# Altium schematic sheet BMS Master.SchDoc
size A; DrawnBy: Not Alvin Ha
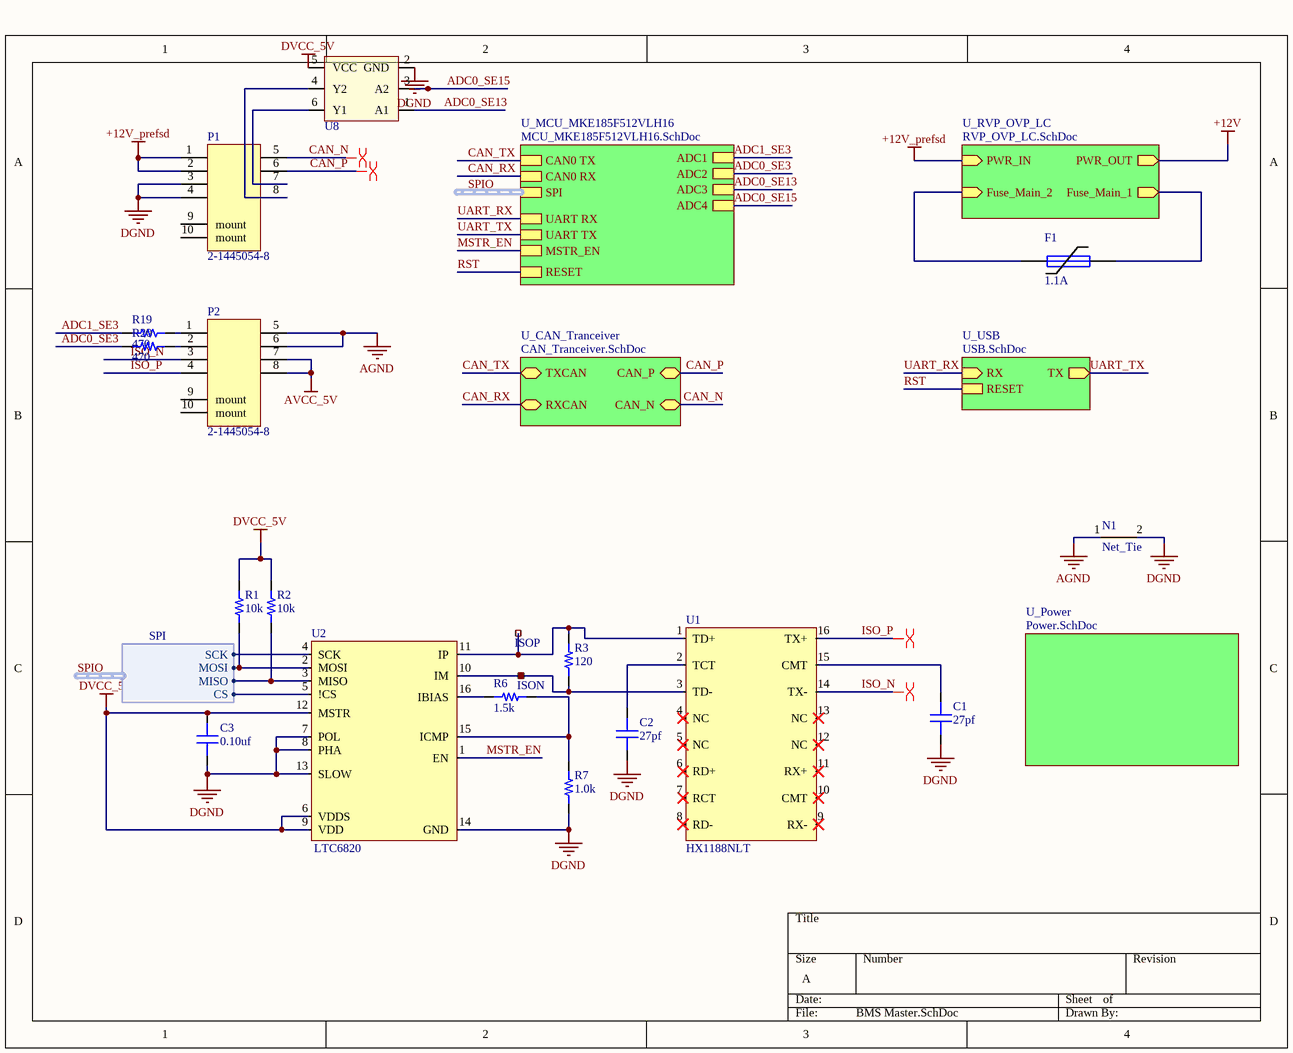
[diagram p0: BMS Master.SchDoc]

## Parts
C1  value 27pf  [CAP 0603/1608]  (hidden comment: Capacitor MLCC 27pf 25V CAP 0603/1608)
C2  value 27pf  [CAP 0603/1608]  (hidden comment: Capacitor MLCC 27pf 25V CAP 0603/1608)
C3  value 0.10uf  [CAP 0603/1608]  (hidden comment: Capacitor MLCC 0.10uf 25V CAP 0603/1608)
F1  I_hold: 1.1A  [PTC Fuse 1206/3216]  (hidden comment: 2.2A)
ISON  RCU-0C  [RCU-0C]  (value not drawn)
ISOP  RCU-0C  [RCU-0C]  (value not drawn)
N1  Net_Tie  [Net_Tie]  (net tie, no BOM)
P1  2-1445054-8  [2-1445054-8]
P2  2-1445054-8  [2-1445054-8]
R1  value 10k  [RES 0603/1608]  (hidden comment: Resistor 10k 0603 1/10W 5%)
R2  value 10k  [RES 0603/1608]  (hidden comment: Resistor 10k 0603 1/10W 5%)
R3  value 120  [RES 0603/1608]  (hidden comment: Resistor 120 0603 1/10W 5%)
R6  value 1.5k  [RES 0603/1608]  (hidden comment: Resistor 1.5k 0603 1/10W 5%)
R7  value 1.0k  [RES 0603/1608]  (hidden comment: Resistor 1.0k 0603 1/10W 5%)
R19  value 470  [RES 0603/1608]  (hidden comment: Resistor 470 0603 1/10W 5%)
R20  value 470  [RES 0603/1608]  (hidden comment: Resistor 470 0603 1/10W 5%)
U1  HX1188NLT  [HX1188NLT]
U2  LTC6820  [MSOP-16]
U8  comment  [6-TSSOP]  (value not drawn)

## Sub-sheets
U_CAN_Tranceiver = CAN_Tranceiver.SchDoc: TXCAN (bidir), RXCAN (bidir), CAN_P (bidir), CAN_N (bidir)
U_MCU_MKE185F512VLH16 = MCU_MKE185F512VLH16.SchDoc: CAN0 TX, CAN0 RX, ADC4, ADC3, ADC2, ADC1, SPI (harness *), MSTR_EN, UART RX, UART TX, RESET
U_Power = Power.SchDoc: no entries
U_RVP_OVP_LC = RVP_OVP_LC.SchDoc: PWR_IN (in), PWR_OUT (out), Fuse_Main_2 (in), Fuse_Main_1 (out)
U_USB = USB.SchDoc: TX (out), RX (in), RESET

## Harnesses
SPI: SCK, MOSI, MISO, CS

## Nets
+12V: sheet U_RVP_OVP_LC/PWR_OUT
+12V_prefsd: P1.1 P1.2 ; sheet U_RVP_OVP_LC/PWR_IN
AGND: N1.1 P2.5 P2.6
AVCC_5V: P2.7 P2.8
DGND: C1.1 C2.1 C3.2 N1.2 P1.3 P1.4 R7.1 U2.7(POL) U2.8(PHA) U2.13(SLOW) U2.14(GND) U8.2(GND)
DVCC_5V: C3.1 R1.2 R2.2 U2.6(VDDS) U2.9(VDD) U2.12(MSTR) U8.5(VCC)
ADC0_SE3: R20.1 ; sheet U_MCU_MKE185F512VLH16/ADC2
ADC0_SE13: U8.1(A1) ; sheet U_MCU_MKE185F512VLH16/ADC3
ADC0_SE15: U8.3(A2) ; sheet U_MCU_MKE185F512VLH16/ADC4
ADC1_SE3: R19.1 ; sheet U_MCU_MKE185F512VLH16/ADC1
CAN_N: P1.5 ; sheet U_CAN_Tranceiver/CAN_N
CAN_P: P1.6 ; sheet U_CAN_Tranceiver/CAN_P
CAN_RX: sheet U_CAN_Tranceiver/RXCAN, sheet U_MCU_MKE185F512VLH16/CAN0 RX
CAN_TX: sheet U_CAN_Tranceiver/TXCAN, sheet U_MCU_MKE185F512VLH16/CAN0 TX
ISO_N: P2.3 U1.14(TX-)
ISO_P: P2.4 U1.16(TX+)
MSTR_EN: U2.1(EN) ; sheet U_MCU_MKE185F512VLH16/MSTR_EN
RST: sheet U_USB/RESET, sheet U_MCU_MKE185F512VLH16/RESET
SPIO.CS: U2.5(!CS) ; sheet U_MCU_MKE185F512VLH16/SPI.CS
SPIO.MISO: R2.1 U2.3(MISO) ; sheet U_MCU_MKE185F512VLH16/SPI.MISO
SPIO.MOSI: R1.1 U2.2(MOSI) ; sheet U_MCU_MKE185F512VLH16/SPI.MOSI
SPIO.SCK: U2.4(SCK) ; sheet U_MCU_MKE185F512VLH16/SPI.SCK
UART_RX: sheet U_USB/RX, sheet U_MCU_MKE185F512VLH16/UART RX
UART_TX: sheet U_USB/TX, sheet U_MCU_MKE185F512VLH16/UART TX
NetC1_2: C1.2 U1.15(CMT)
NetC2_2: C2.2 U1.2(TCT)
NetF1_1: F1.1 ; sheet U_RVP_OVP_LC/Fuse_Main_2
NetF1_2: F1.2 ; sheet U_RVP_OVP_LC/Fuse_Main_1
NetISON_1: ISON.1 R3.1 U1.3(TD-) U2.10(IM)
NetISOP_1: ISOP.1 R3.2 U1.1(TD+) U2.11(IP)
NetP1_7: P1.7 U8.6(Y1)
NetP1_8: P1.8 U8.4(Y2)
NetP2_1: P2.1 R19.2
NetP2_2: P2.2 R20.2
NetR6_1: R6.1 U2.16(IBIAS)
NetR6_2: R6.2 R7.2 U2.15(ICMP)

Not connected (* = marked no-connect by the designer): P1 9(mount) 10(mount); P2 9(mount) 10(mount); U1 4(NC)* 5(NC)* 6(RD+)* 7(RCT)* 8(RD-)* 9(RX-)* 10(CMT)* 11(RX+)* 12(NC)* 13(NC)*

## Buses and harness runs
harness SPIO = sheet U_MCU_MKE185F512VLH16/SPI

## Layout directives
differential pair: CAN_N, CAN_P, ISO_N, ISO_P

## Library data of the parts
C1 C2 = 515: Manufacturer_id: 1; idCapacitor: 515; Name: Cap_27pf_25V_CAP 0603/1608; Dielectric: Ceramic; Created_By: Nick Mah; Drawer_id: 1; Voltage_Rating: 25V; Package: CAP 0603/1608; Created_Date: 10/20/2018
C3 = 583: Manufacturer_id: 1; idCapacitor: 583; Name: Cap_0.10uf_25V_CAP 0603/1608; Dielectric: Ceramic; Created_By: Nick Mah; Drawer_id: 1; Voltage_Rating: 25V; Package: CAP 0603/1608; Created_Date: 10/20/2018
F1 = 8: Fuse; Manufacturer_id: 1; MfrPartNo: 1206L110/12SLYR; idFuse: 8; Name: Resettable; I_max: 50A; V_max: 12V; Pd_Typ: .8W; Published: 8-Jun-2000; LatestRevisionDate: 17-Jul-2002; LatestRevisionNote: Re-released for DXP Platform.; PackageReference: PIN-W2/E2.8; Publisher: Altium Limited; PackageDescription: Thru-Hole; 2 Leads; Drawer_id: 1; I_trip: 2.2A; Link: https://www.digikey.com/product-detail/en/littelfuse-inc/1206L110-12SLYR/F5764CT-ND/3593809
ISON ISOP = 14: Test point; Manufacturer_id: 1; idConn: 14; Value: CONN; Created_By: Graydon; Updated_By: Null; Drawer_id: 1; Name: RCU-0C; Num_Contacts: 1; Num_Rows: 1; Package: RCU-0C; MfrPartNo: RCU-0C; Link: https://www.digikey.com/product-detail/en/te-connectivity-amp-connectors/RCU-0C/A106145CT-ND/3477802; ComponentLink1Description: Null; ComponentLink1URL: Null; Supplier1: None; Supplier1PartNo: None; Created_Date: 11/10/2018
N1 = 1: Manufacturer_id: 1; idFuse: 3; Name: Net Tie; Drawer_id: 1; idShunt: 1
P1 P2 = 12: 1x8 connector; Manufacturer_id: 5; idConn: 12; Drawer_id: 1; Name: Micro MATE-N-LOK 1x8; Num_Contacts: 8; Created_By: Graydon; Num_Rows: 1; MfrPartNo: 2-1445054-8; Link: https://www.digikey.com/product-detail/en/te-connectivity-amp-connectors/2-1445054-8/2-1445054-8-ND/1890093; ComponentLink1Description: Datasheet; Supplier1: Digi-Key; Supplier1PartNo: 2-1445054-8-ND; Created_Date: 11/10/2018
R1 R2 = 1393: Manufacturer_id: 1; idResistor: 1393; Name: Res_10k_0603_1/10W_5%; Created_By: Nick Mah; Supplier 1: Digi-Key; Drawer_id: 1; Tolerance: 5%; Power: 1/10W; Package: 0603; ComponentLink1Description: Datasheet; Created_Date: 2018-10-20
R3 = 1347: Manufacturer_id: 1; idResistor: 1347; Name: Res_120_0603_1/10W_5%; Created_By: Nick Mah; Supplier 1: Digi-Key; Drawer_id: 1; Tolerance: 5%; Power: 1/10W; Package: 0603; ComponentLink1Description: Datasheet; Created_Date: 2018-10-20
R6 = 1373: Manufacturer_id: 1; idResistor: 1373; Name: Res_1.5k_0603_1/10W_5%; Created_By: Nick Mah; Supplier 1: Digi-Key; Drawer_id: 1; Tolerance: 5%; Power: 1/10W; Package: 0603; ComponentLink1Description: Datasheet; Created_Date: 2018-10-20
R7 = 1369: Manufacturer_id: 1; idResistor: 1369; Name: Res_1.0k_0603_1/10W_5%; Created_By: Nick Mah; Supplier 1: Digi-Key; Drawer_id: 1; Tolerance: 5%; Power: 1/10W; Package: 0603; ComponentLink1Description: Datasheet; Created_Date: 2018-10-20
R19 R20 = 1361: Manufacturer_id: 1; idResistor: 1361; Name: Res_470_0603_1/10W_5%; Created_By: Nick Mah; Supplier 1: Digi-Key; Drawer_id: 1; Tolerance: 5%; Power: 1/10W; Package: 0603; ComponentLink1Description: Datasheet; Created_Date: 2018-10-20
U1 = 8: Manufacturer_id: 1; idFuse: 3; idIC_Interface: 8; Num_Circuits: 2; Created_By: Angel; Drawer_id: 1; Name: HX1188NLT; Type: Magnetic Isolation; Package: HX1188NLT; MfrPartNo: HX1188NLT; Link: https://www.digikey.com/product-detail/en/pulse-electronics-network/HX1188NLT/553-1536-1-ND/3151809?utm_adgroup=Transformers&slid=&gclid=CjwKCAiAhp_jBRAxEiwAXbniXRrdDycXKcdMEppGgTacWMJf80VG2GQDdYxlb9yRzxEZsto0mBbjlhoCtm4QAvD_BwE
U2 = 7: soSPI Isolated / Communications Interface; Manufacturer_id: 1; idFuse: 3; idIC_Interface: 7; Protocol: isoSPI; Vin(Min): 2.7V; Vin(Max): 5.5V; Created_By: Angel; Drawer_id: 1; Name: LTC6820; Type: bidirectional; Num_Circuits: 1; Package: MSOP-16; MfrPartNo: LTC6820; Link: https://www.mouser.com/ProductDetail/Analog-Devices/LTC6820IMSPBF?qs=sGAEpiMZZMvi6wO7nhr1LyTLeBC7dAWQpR44bZH0zYY%3d
U8 = 10: Buffer dual high speed; Manufacturer_id: 1; MfrPartNo: NC7WZ07P6X; idIC_Interface: 10; Name: Buffer 2x; Value: None; Num_Circuits: 2; Data_Rate: 2.3ns; Vin(Min): 1.65V; Vin(Max): 5.5V; Created_By: gray; Updated_By: Null; Drawer_id: 1; Type: Buffer; Protocol: None; Package: 6-TSSOP; Link: https://www.digikey.com/product-detail/en/on-semiconductor/NC7WZ07P6X/NC7WZ07P6XCT-ND/965702; ComponentLink1Description: Digikey; ComponentLink1URL: https://www.digikey.com/product-detail/en/on-semiconductor/NC7WZ07P6X/NC7WZ07P6XCT-ND/965702; Supplier1: Digikey; Supplier1PartNo: NC7WZ07P6XCT-ND; Created_Date: 3/6/2019